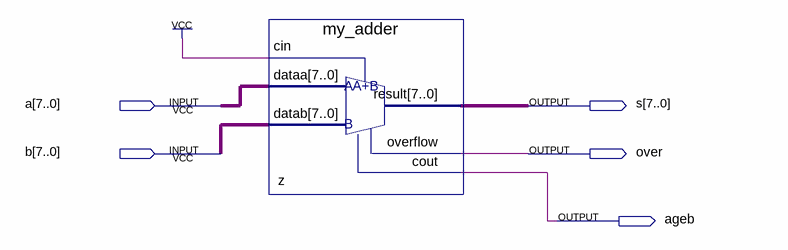
[diagram p0: schematic sheet]
// Quartus schematic adder_mod_comp.bdf as structural Verilog: 1 symbols, 5 pins
module adder_mod_comp (
  input  [7:0] a,
  input  [7:0] b,
  output [7:0] s,
  output over,
  output ageb
);

  my_adder z (.cin(1'b1), .dataa(a), .datab(b), .cout(ageb), .overflow(over), .result(s));
endmodule
